# Altium schematic sheet RS485_2.SchDoc
size A4; SheetNumber: 3; SheetTotal: 14
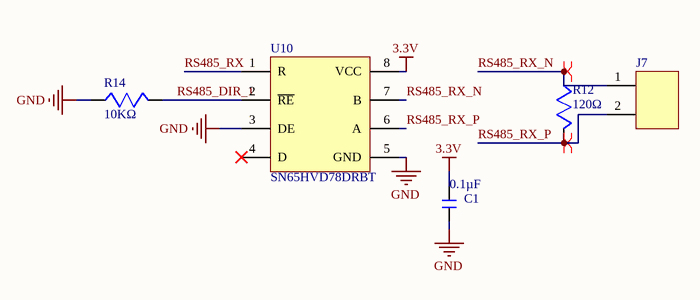
[diagram p0: RS485_2.SchDoc]

## Parts
C1  value 0.1µF  [402 capacitor - duplicate]  (hidden comment: 0402 capacitor)
J7  2 POS  [0901362102]  (value not drawn)
R12  value 120Ω  [402 RESISTOR]  (hidden comment: 0402. RESİSTOR)
R14  value 10KΩ  [402 RESISTOR]  (hidden comment: 0402. RESİSTOR)
U10  SN65HVD78DRBT

## Nets
3.3V: C1.2 U10.8(VCC)
GND: C1.1 R14.1 U10.3(DE) U10.5(GND)
RS485_DIR_1: R14.2 U10.2(~{RE})
RS485_RX: U10.1(R)
RS485_RX_N: J7.1 R12.1 U10.7(B)
RS485_RX_P: J7.2 R12.2 U10.6(A)

Not connected (* = marked no-connect by the designer): U10 4(D)*

## Layout directives
differential pair; net class 485_RX_N; differential pair class DIF_100: RS485_RX_N
differential pair; net class 485_RX_P; differential pair class DIF_100: RS485_RX_P

## Library data of the parts
C1 = CON SMD 402: MPN: CL05A104KA5NNNC; Package: 0402
J7 = 0901362102: CONN HEADER R/A 2POS 2.54MM; MPN: 0901362102
R12 = RES SMD 0402: MPN: ERJ-2RKF1200X; Package: 0402
R14 = RES SMD 0402: MPN: RNCF0402BTE10K0; Package: 0402
U10 = SN65HVD78DRBT: IC TRANSCEIVER HALF 1/1 8SON; MPN: SN65HVD78DRBT